# Altium schematic sheet 2022_AESK_UAV_CONNECTOR.SchDoc
size A4; Organization: AESK; Address1: Designer by:; Address3: FATİH CAN; SheetNumber: 6; SheetTotal: 6
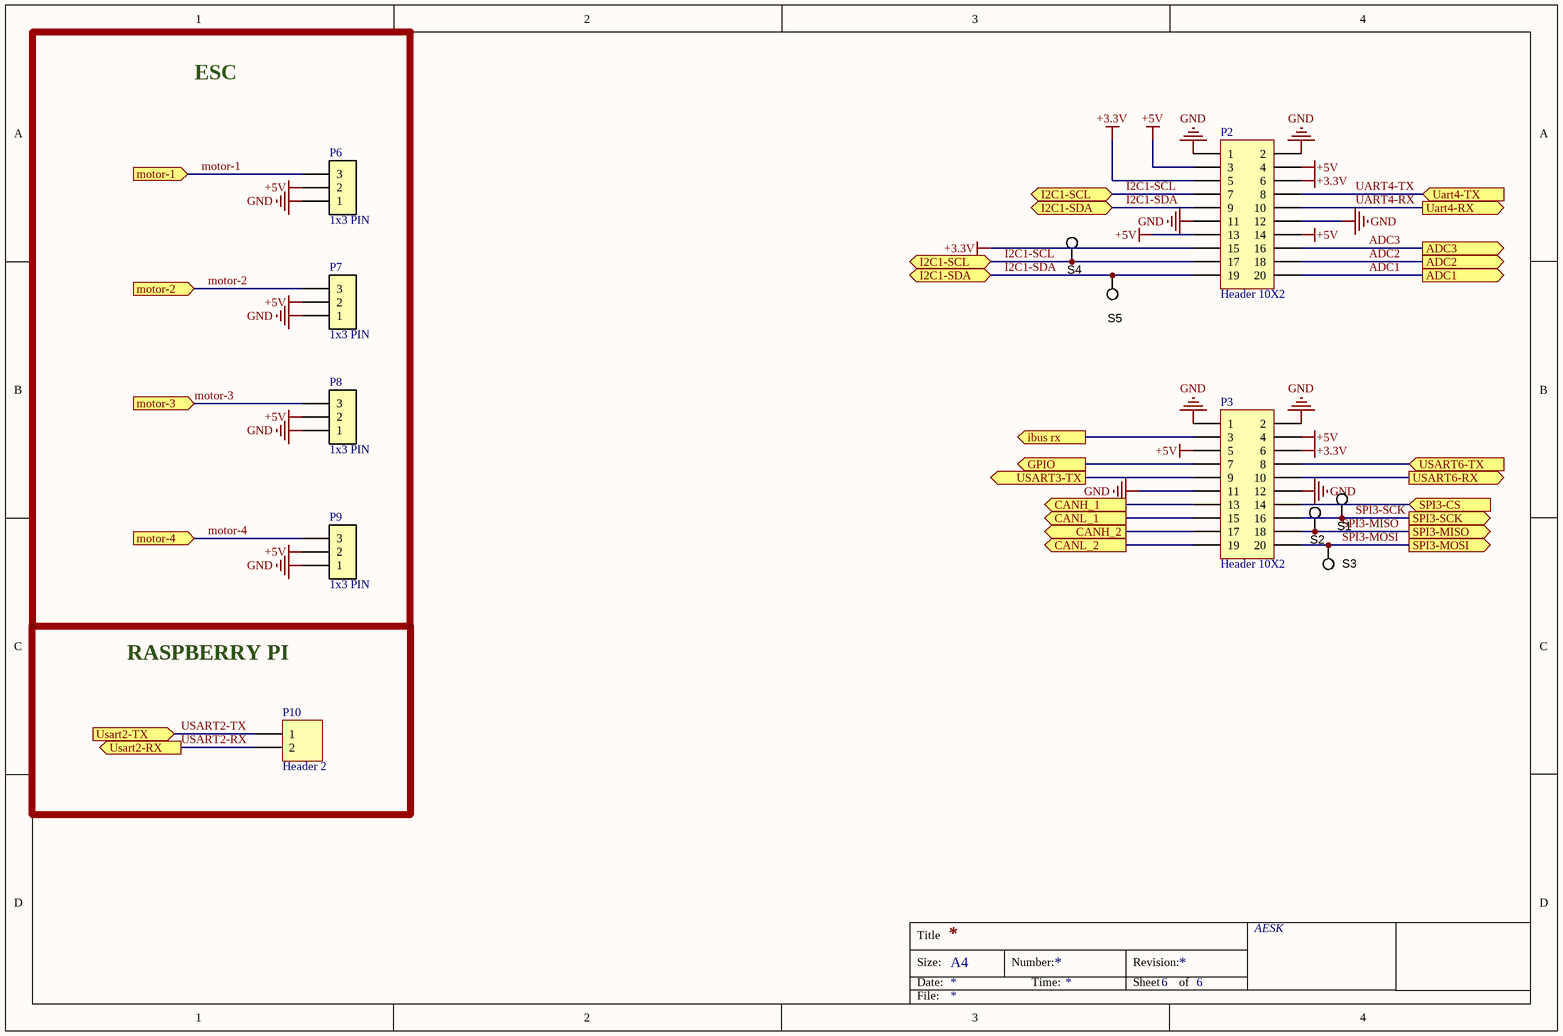
[diagram p0: 2022_AESK_UAV_CONNECTOR.SchDoc]

## Parts
P2  Header 10X2  [HDR2X10]
P3  Header 10X2  [HDR2X10]
P6  1x3 PIN  [HDR_2.54_1X3]
P7  1x3 PIN  [HDR_2.54_1X3]
P8  1x3 PIN  [HDR_2.54_1X3]
P9  1x3 PIN  [HDR_2.54_1X3]
P10  Header 2  [HDR1X2]
S1  5002  [Keystone5002]  (value not drawn)
S2  5002  [Keystone5002]  (value not drawn)
S3  5002  [Keystone5002]  (value not drawn)
S4  5002  [Keystone5002]  (value not drawn)
S5  5002  [Keystone5002]  (value not drawn)

## Ports
ADC1 (out), ADC2 (out), ADC3 (out), CANH_1 (out), CANH_2 (out), CANL_1 (out), CANL_2 (out), GPIO (out), I2C1-SCL (bidir), I2C1-SDA (bidir), ibus rx (out), motor-1 (in), motor-2 (in), motor-3 (in), motor-4 (in), SPI3-CS (in), SPI3-MISO (out), SPI3-MOSI (out), SPI3-SCK (out), Uart4-RX (out), Uart4-TX (in), Usart2-RX (out), Usart2-TX (in), USART3-TX (out), USART6-RX (out), USART6-TX (in)

## Nets
+3.3V: P2.5 P2.6 P2.15 P3.6
+5V: P2.3 P2.4 P2.13 P2.14 P3.4 P3.5 P6.2 P7.2 P8.2 P9.2
GND: P2.1 P2.2 P2.11 P2.12 P3.1 P3.2 P3.11 P3.12 P6.1 P7.1 P8.1 P9.1
ADC1: P2.20 ; port ADC1
ADC2: P2.18 ; port ADC2
ADC3: P2.16 ; port ADC3
CANH_1: P3.13 ; port CANH_1
CANH_2: P3.17 ; port CANH_2
CANL_1: P3.15 ; port CANL_1
CANL_2: P3.19 ; port CANL_2
GPIO: P3.7 ; port GPIO
I2C1-SCL: P2.7 P2.17 S4.1 ; port I2C1-SCL
I2C1-SDA: P2.9 P2.19 S5.1 ; port I2C1-SDA
ibus rx: P3.3 ; port ibus rx
motor-1: P6.3 ; port motor-1
motor-2: P7.3 ; port motor-2
motor-3: P8.3 ; port motor-3
motor-4: P9.3 ; port motor-4
SPI3-CS: P3.14 ; port SPI3-CS
SPI3-MISO: P3.18 S2.1 ; port SPI3-MISO
SPI3-MOSI: P3.20 S3.1 ; port SPI3-MOSI
SPI3-SCK: P3.16 S1.1 ; port SPI3-SCK
UART4-RX: P2.10 ; port Uart4-RX
UART4-TX: P2.8 ; port Uart4-TX
USART2-RX: P10.2 ; port Usart2-RX
USART2-TX: P10.1 ; port Usart2-TX
USART3-TX: P3.9 ; port USART3-TX
USART6-RX: P3.10 ; port USART6-RX
USART6-TX: P3.8 ; port USART6-TX

## Notes on the sheet
- ESC
- RASPBERRY PI
- Title
- Size:
- Date:
- A4
- Number:
- Time:
- Revision:
- Sheet
- of
- File:

## Library data of the parts
P2 P3 = Header 10X2: Header, 10-Pin, Dual row; LatestRevisionDate: 17-Jul-2002; LatestRevisionNote: Re-released for DXP Platform.; Publisher: Altium Limited
P6-P9 = Connector0009: Header 2.54 1x3; Part Number: Connector0009; Category: Connectors; Package / Case: HDR_2.54_1X3; Values: Header 2.54 1x3
P10 = Header 2: Header, 2-Pin; LatestRevisionDate: 17-Jul-2002; LatestRevisionNote: Re-released for DXP Platform.; Publisher: Altium Limited
S1-S5 = 5002: Test Point, TH, Miniature, White; Manufacturer: Keystone; CompType: Test Point Loop; U/M: EA; RoHS: Y; DigiKeyPartNumber: 5002K-ND; Value: White; SymbolVersion: 2008-04-04; PartNumber: 5002; PackageReference: Keystone5002; ComponentLink1Description: Datasheet Link; ComponentLink1URL: http://www.keyelco.com/pdfs/M55p51.pdf; MountType: TH; Publisher: National Semiconductor; LatestRevisionDate: 2011-09-29; LatestRevisionNote: Removed DigiKeyPartNumber parameter.; Alternate Manufacturer: -; Alternate PartNumber: -; Supplier 1: Digi-Key; Supplier Part Number 1: 5002K-ND; Supplier 2: Newark; Supplier Part Number 2: 82H9632